# EAGLE design fish (EAGLE 9.6.2)
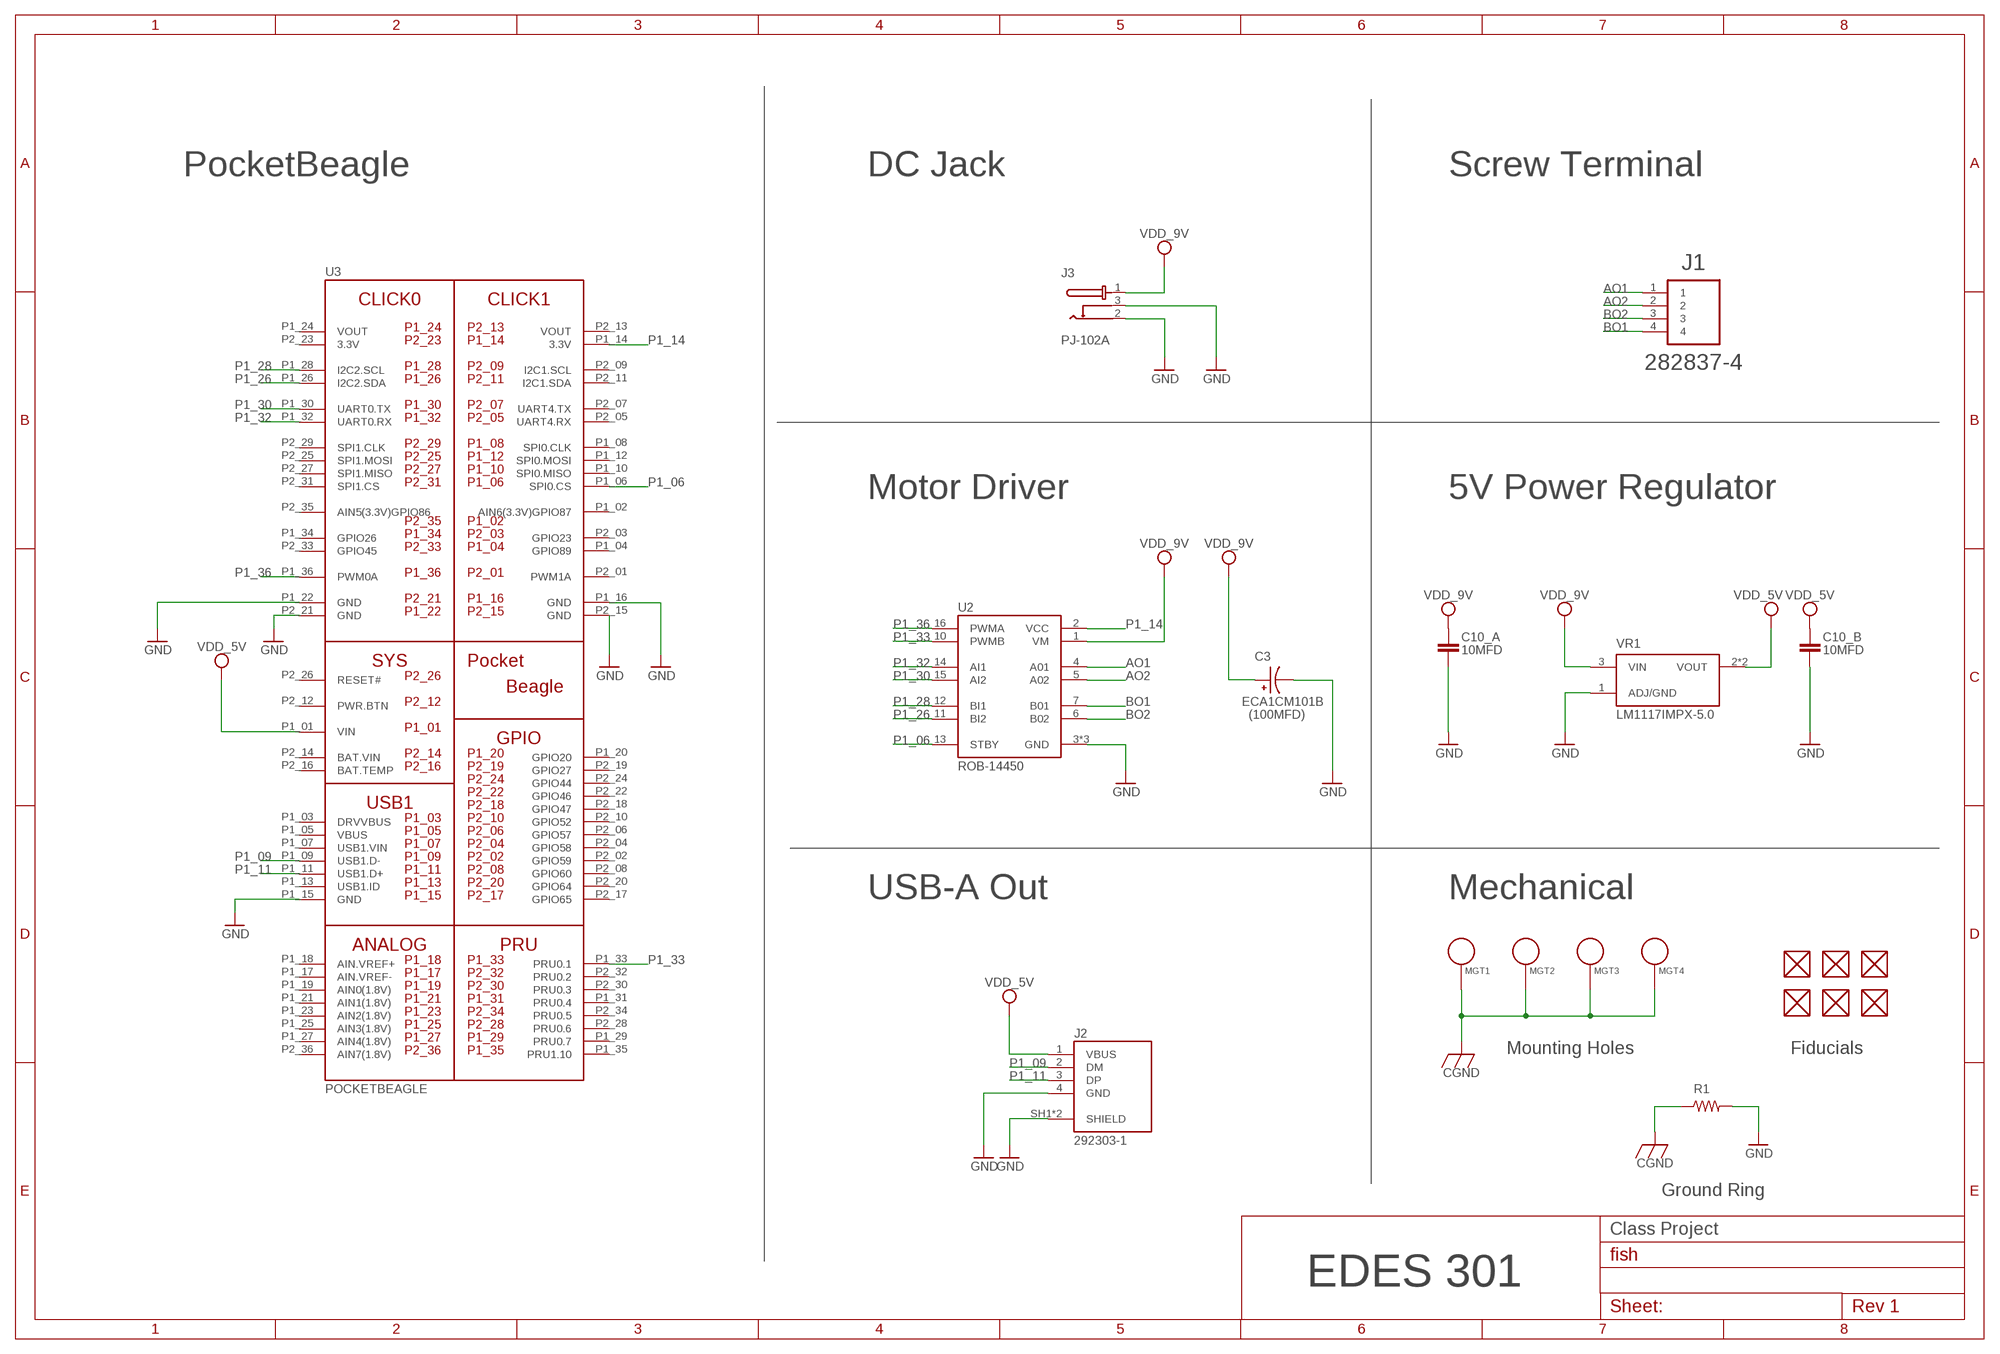
[diagram p0: schematic, sheet 1]

## Parts
C3  ECA1CM101B  [CAPPRD500W50D500H1100]
C10_A  10MFD  C_C0805  [C0805]
C10_B  10MFD  C_C0805  [C0805]
FUD1  FIDUCIAL  [FIDUCIAL_40MIL]
FUD2  FIDUCIAL  [FIDUCIAL_40MIL]
FUD3  FIDUCIAL  [FIDUCIAL_40MIL]
FUD4  FIDUCIAL  [FIDUCIAL_40MIL]
FUD5  FIDUCIAL  [FIDUCIAL_40MIL]
FUD6  FIDUCIAL  [FIDUCIAL_40MIL]
J1  282837-4  [TE_282837-4]
J2  292303-1  [TE_292303-1]
J3  PJ-102A  [CUI_PJ-102A]
MGT1  MOUNTING_HOLE  [MOUNTING_HOLE]
MGT2  MOUNTING_HOLE  [MOUNTING_HOLE]
MGT3  MOUNTING_HOLE  [MOUNTING_HOLE]
MGT4  MOUNTING_HOLE  [MOUNTING_HOLE]
R1  1 Ohm  R_R0402  [R0402]
U2  ROB-14450  [MODULE_ROB-14450]
U3  POCKETBEAGLE  [POCKETBEAGLE]
VR1  LM1117IMPX-5.0  [SOT230P700X180-4N]

## Nets
AO1: J1.1 U2.4(A01)
AO2: J1.2 U2.5(A02)
BO1: J1.4 U2.7(B01)
BO2: J1.3 U2.6(B02)
CGND: MGT1.P$1 MGT2.P$1 MGT3.P$1 MGT4.P$1 R1.1
GND: C3.N C10_A.2 C10_B.2 J2.4(GND) J2.SH1(SHIELD) J2.SH2(SHIELD) J3.2 J3.3 R1.2 U2.3(GND) U2.8(GND) U2.9(GND) U3.P1_15(GND) U3.P1_16(GND) U3.P1_22(GND) U3.P2_15(GND) U3.P2_21(GND) VR1.1(ADJ/GND)
P1_06: U2.13(STBY) U3.P1_06(SPI0.CS)
P1_09: J2.2(DM) U3.P1_09(USB1.D-)
P1_11: J2.3(DP) U3.P1_11(USB1.D+)
P1_14: U2.2(VCC) U3.P1_14(3.3V)
P1_26: U2.11(BI2) U3.P1_26(I2C2.SDA)
P1_28: U2.12(BI1) U3.P1_28(I2C2.SCL)
P1_30: U2.15(AI2) U3.P1_30(UART0.TX)
P1_32: U2.14(AI1) U3.P1_32(UART0.RX)
P1_33: U2.10(PWMB) U3.P1_33(PRU0.1)
P1_36: U2.16(PWMA) U3.P1_36(PWM0A)
VDD_5V: C10_B.1 J2.1(VBUS) U3.P1_01(VIN) VR1.2(VOUT) VR1.4(VOUT)
VDD_9V: C3.P C10_A.1 J3.1 U2.1(VM) VR1.3(VIN)
Unconnected: FUD1.P$1 FUD2.P$1 FUD3.P$1 FUD4.P$1 FUD5.P$1 FUD6.P$1 U3.P1_02(AIN6(3.3V)GPIO87) U3.P1_03(DRVVBUS) U3.P1_04(GPIO89) U3.P1_05(VBUS) U3.P1_07(USB1.VIN) U3.P1_08(SPI0.CLK) U3.P1_10(SPI0.MISO) U3.P1_12(SPI0.MOSI) U3.P1_13(USB1.ID) U3.P1_17(AIN.VREF-) U3.P1_18(AIN.VREF+) U3.P1_19(AIN0(1.8V)) U3.P1_20(GPIO20) U3.P1_21(AIN1(1.8V)) U3.P1_23(AIN2(1.8V)) U3.P1_25(AIN3(1.8V)) U3.P1_27(AIN4(1.8V)) U3.P1_29(PRU0.7) U3.P1_31(PRU0.4) U3.P1_34(GPIO26) U3.P1_35(PRU1.10) U3.P2_01(PWM1A) U3.P2_02(GPIO59) U3.P2_03(GPIO23) U3.P2_04(GPIO58) U3.P2_05(UART4.RX) U3.P2_06(GPIO57) U3.P2_07(UART4.TX) U3.P2_08(GPIO60) U3.P2_09(I2C1.SCL) U3.P2_10(GPIO52) U3.P2_11(I2C1.SDA) U3.P2_12(PWR.BTN) U3.P2_16(BAT.TEMP) U3.P2_17(GPIO65) U3.P2_18(GPIO47) U3.P2_19(GPIO27) U3.P2_20(GPIO64) U3.P2_22(GPIO46) U3.P2_24(GPIO44) U3.P2_25(SPI1.MOSI) U3.P2_26(RESET#) U3.P2_27(SPI1.MISO) U3.P2_28(PRU0.6) U3.P2_29(SPI1.CLK) U3.P2_30(PRU0.3) U3.P2_31(SPI1.CS) U3.P2_32(PRU0.2) U3.P2_33(GPIO45) U3.P2_34(PRU0.5) U3.P2_35(AIN5(3.3V)GPIO86) U3.P2_36(AIN7(1.8V))

## Notes on the sheet
- PocketBeagle | DC Jack | Screw Terminal
- Motor Driver | 5V Power Regulator
- (100MFD)
- USB-A Out | Mechanical
- Mounting Holes | Fiducials
- Ground Ring
- Class Project
- EDES 301

## Power pins joined to a net without a drawn wire
3.3V: U3.P2_23(3.3V)
BAT.VIN: U3.P2_14(BAT.VIN)
VOUT: U3.P1_24(VOUT) U3.P2_13(VOUT)

## Library data of the parts
C3 = fish:ECA1CM101B: Check availability <https://pricing.snapeda.com/parts/ECA-1CM101B/Panasonic/view-part?ref=eda>; AVAILABILITY: In Stock; CHECK_PRICES: https://www.snapeda.com/parts/ECA-1CM101B/Panasonic/view-part/?ref=eda; DESCRIPTION: Capacitor,Alum Lytic,Cap 100 uF,Tol 20%,Vol-Rtg 16 VDC,Radial,5x11,Tape&Box | Panasonic Electronic Components ECA-1CM101B; MF: Panasonic; MP: ECA-1CM101B; PACKAGE: RADIAL-2 Panasonic; PRICE: None; SNAPEDA_LINK: https://www.snapeda.com/parts/ECA-1CM101B/Panasonic/view-part/?ref=snap
C10_A C10_B = fish:C_: Capacitor SMD. Sizes: 0402, 0603 & 0805
FUD1-FUD6 = fish:FIDUCIAL
J1 = fish:282837-4: Check availability <https://pricing.snapeda.com/parts/282837-4/TE%20Connectivity/view-part?ref=eda>; AVAILABILITY: In Stock; CHECK_PRICES: https://www.snapeda.com/parts/282837-4/TE+Connectivity+AMP+Connectors/view-part/?ref=eda; COMMENT: 282837-4; DESCRIPTION: Terminal Block Connector,PCB,4,5.08 mm,Front,30-16 AWG,Green,13.5 A,250 V | TE Connectivity 282837-4; EU_ROHS_COMPLIANCE: Compliant with Exemptions; MF: TE Connectivity; MP: 282837-4; PACKAGE: None; PRICE: None; SNAPEDA_LINK: https://www.snapeda.com/parts/282837-4/TE+Connectivity+AMP+Connectors/view-part/?ref=snap
J2 = fish:292303-1: CONN USB RECEPT R/A TYPE A 4POS Check availability <https://pricing.snapeda.com/parts/292303-1/TE%20Connectivity/view-part?ref=eda>; AVAILABILITY: In Stock; CENTERLINE_PITCH: 2 mm[.078 in]; COMMENT: 292303-1; DESCRIPTION: Conn; Data; USB; Recept; 2.0; 4 Pos; 1 Port; Rt Angle; A Ser; Tin over Copper; EU_ROHS_COMPLIANCE: Compliant; MF: TE Connectivity; MP: 292303-1; NUMBER_OF_POSITIONS: 4; PACKAGE: None; PRICE: None; PRODUCT_TYPE: Connector; PURCHASE-URL: https://pricing.snapeda.com/search/part/292303-1/?ref=eda
J3 = fish:PJ-102A: Check availability <https://pricing.snapeda.com/parts/PJ-102A/Same%20Sky/view-part?ref=eda>; AVAILABILITY: In Stock; CHECK_PRICES: https://www.snapeda.com/parts/PJ-102A/Same+Sky/view-part/?ref=eda; DESCRIPTION: 2.0 x 6.5 mm, 2.5 A, Horizontal, Through Hole, Tapered Pins, Dc Power Jack Connector; MF: Same Sky; MP: PJ-102A; PACKAGE: None; PRICE: None; SNAPEDA_LINK: https://www.snapeda.com/parts/PJ-102A/Same+Sky/view-part/?ref=snap
MGT1-MGT4 = fish:MOUNTING_HOLE: Chassis Mounting Hole w/GND connection ability
R1 = fish:R_: RESISTOR, American symbol
U2 = fish:ROB-14450: Check availability <https://pricing.snapeda.com/parts/ROB-14450/SparkFun%20Electronics/view-part?ref=eda>; AVAILABILITY: Not in stock; CHECK_PRICES: https://www.snapeda.com/parts/ROB-14450/SparkFun/view-part/?ref=eda; DESCRIPTION: TB6612FNG - Motor Controller/Driver Power Management Evaluation Board; MF: SparkFun Electronics; MP: ROB-14450; PACKAGE: None; PRICE: None; PURCHASE-URL: https://www.snapeda.com/api/url_track_click_mouser/?unipart_id=2656367&manufacturer=SparkFun Electronics&part_name=ROB-14450&search_term=None; SNAPEDA_LINK: https://www.snapeda.com/parts/ROB-14450/SparkFun/view-part/?ref=snap
U3 = fish:POCKETBEAGLE
VR1 = fish:LM1117IMPX-5.0: Check availability <https://pricing.snapeda.com/parts/LM1117IMPX-5.0/Texas%20Instruments/view-part?ref=eda>; AVAILABILITY: In Stock; CHECK_PRICES: https://www.snapeda.com/parts/LM1117IMPX-5.0/Texas+Instruments/view-part/?ref=eda; DESCRIPTION: Linear Voltage Regulator IC Positive Fixed 1 Output 800mA SOT-223-4; MF: Texas Instruments; MP: LM1117IMPX-5.0; PACKAGE: SOT-223-4 Texas Instruments; PRICE: None; SNAPEDA_LINK: https://www.snapeda.com/parts/LM1117IMPX-5.0/Texas+Instruments/view-part/?ref=snap

## Board
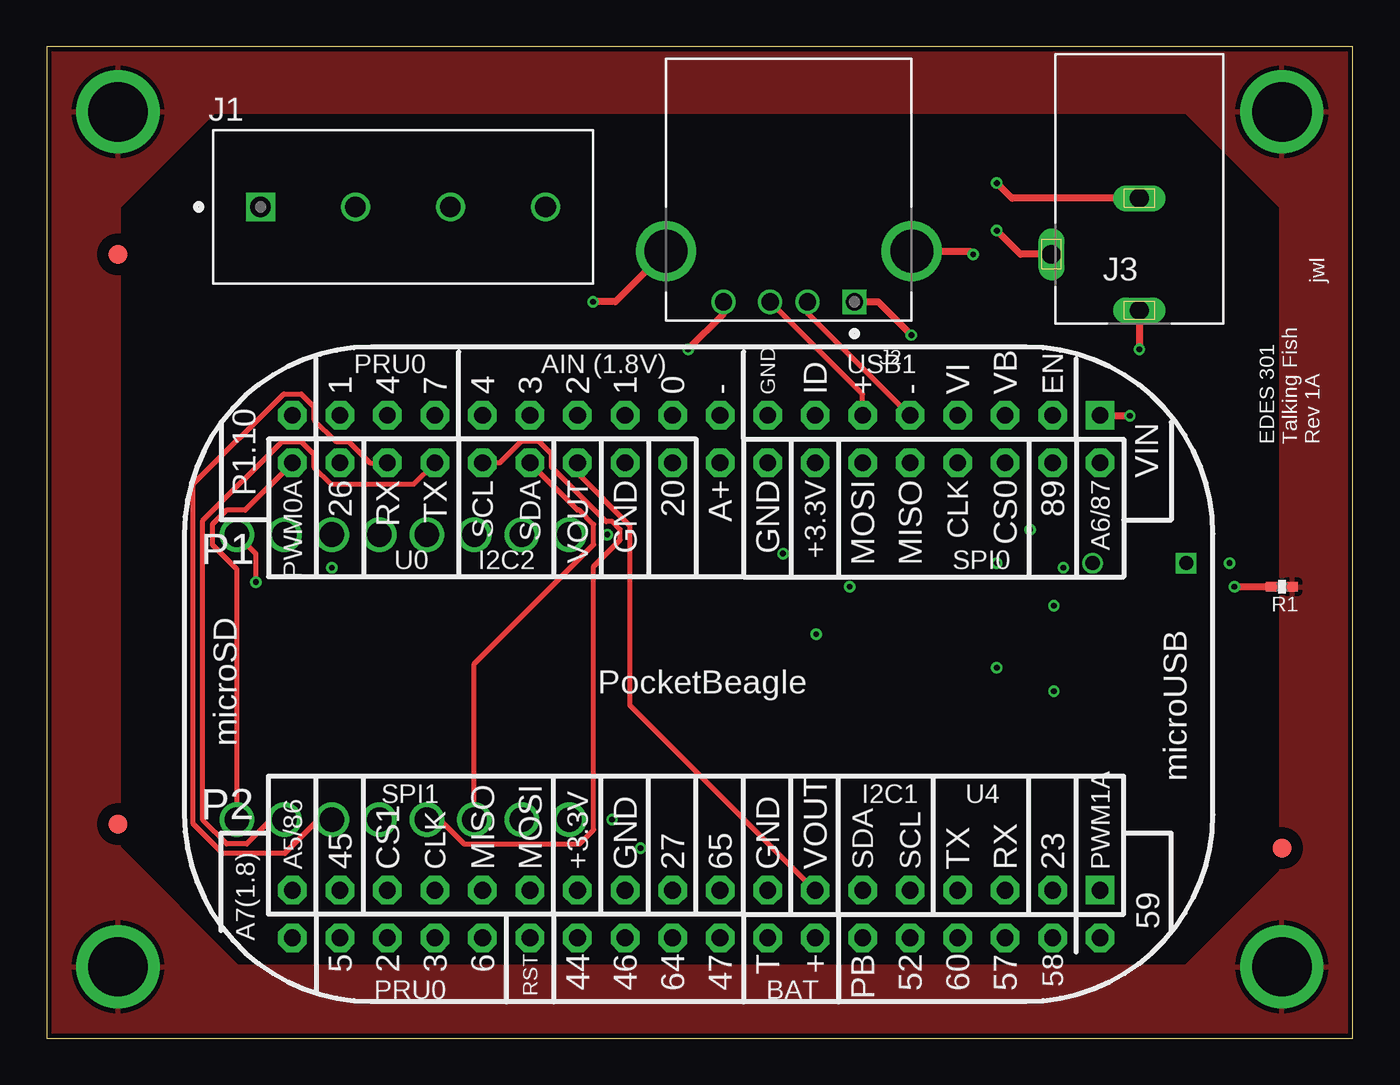
[diagram p1: board, top side]
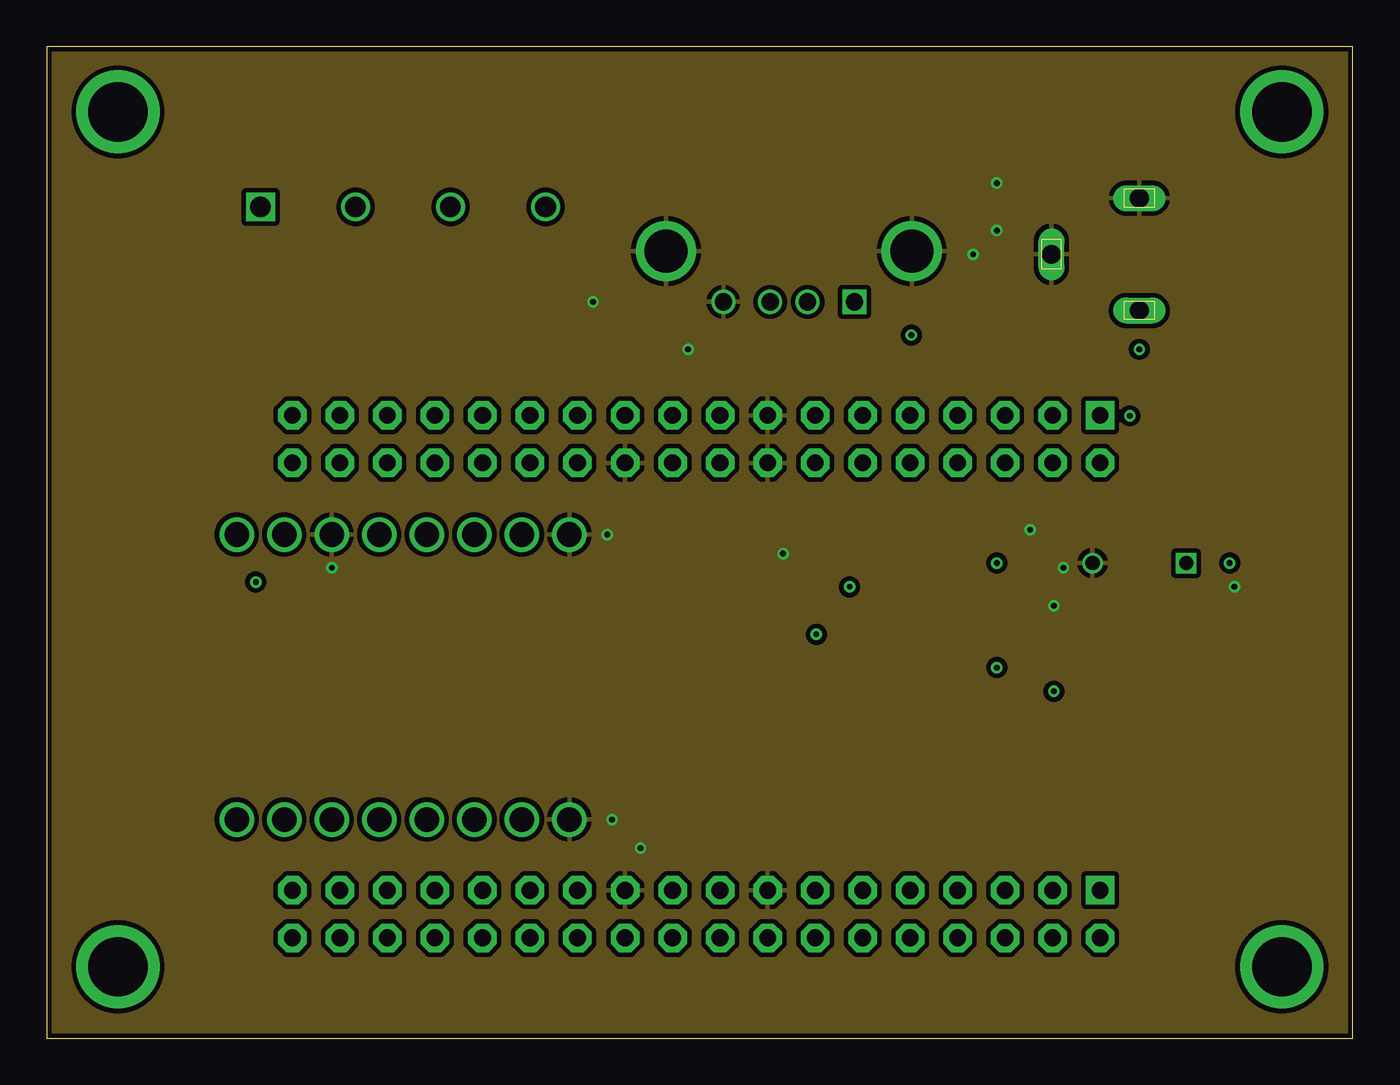
[diagram p2: board, inner layer Route2]
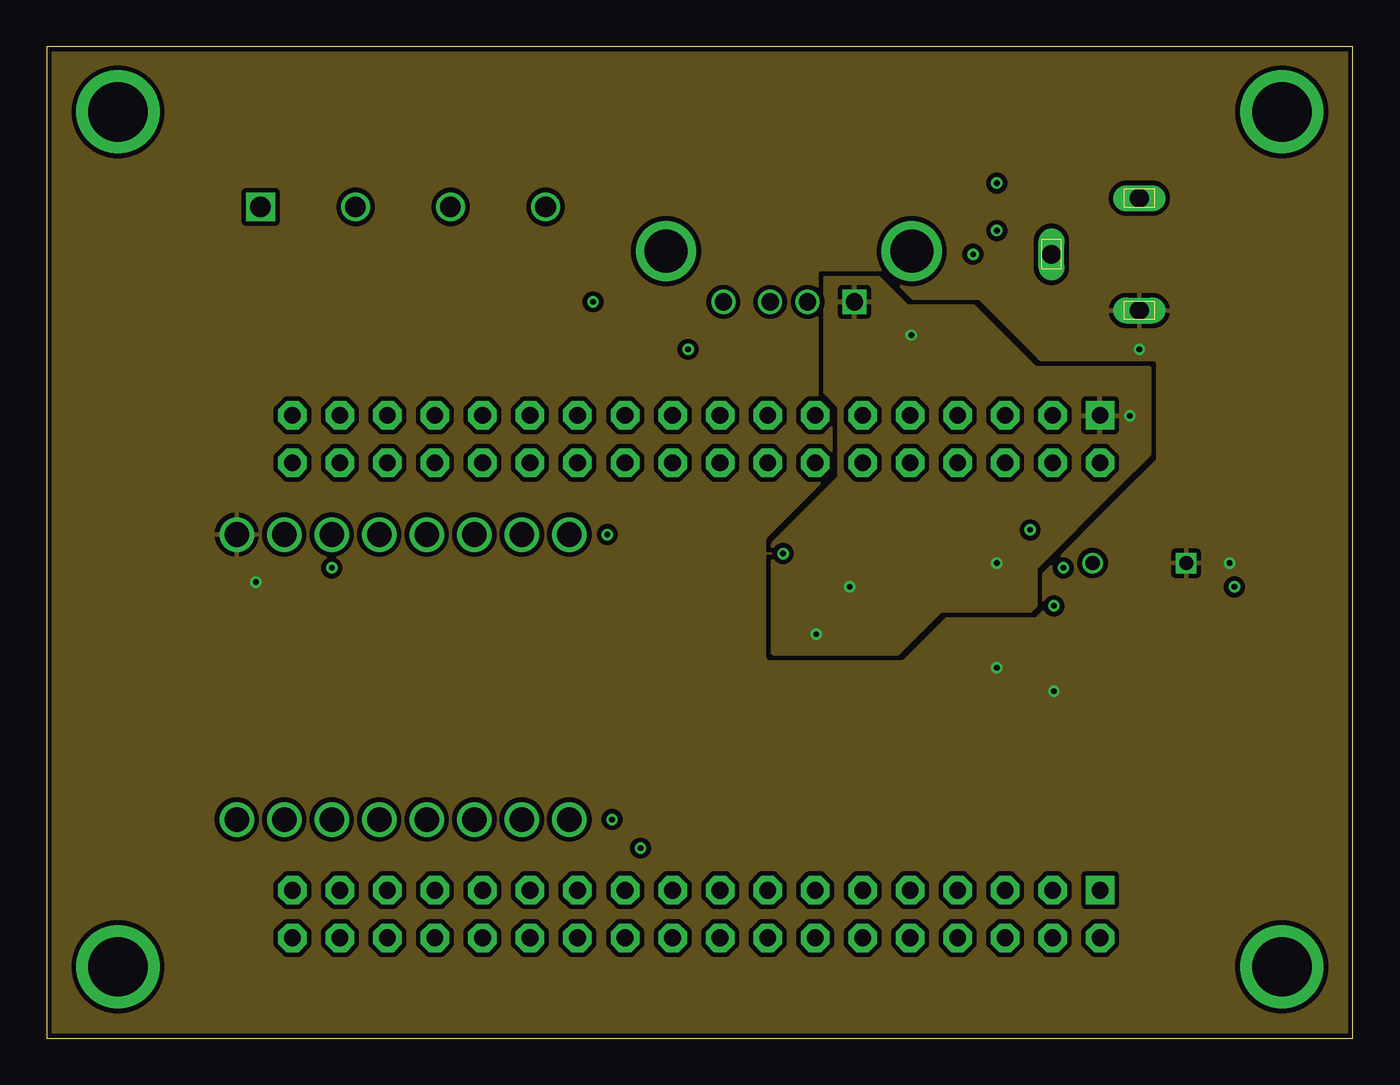
[diagram p3: board, inner layer Route15]
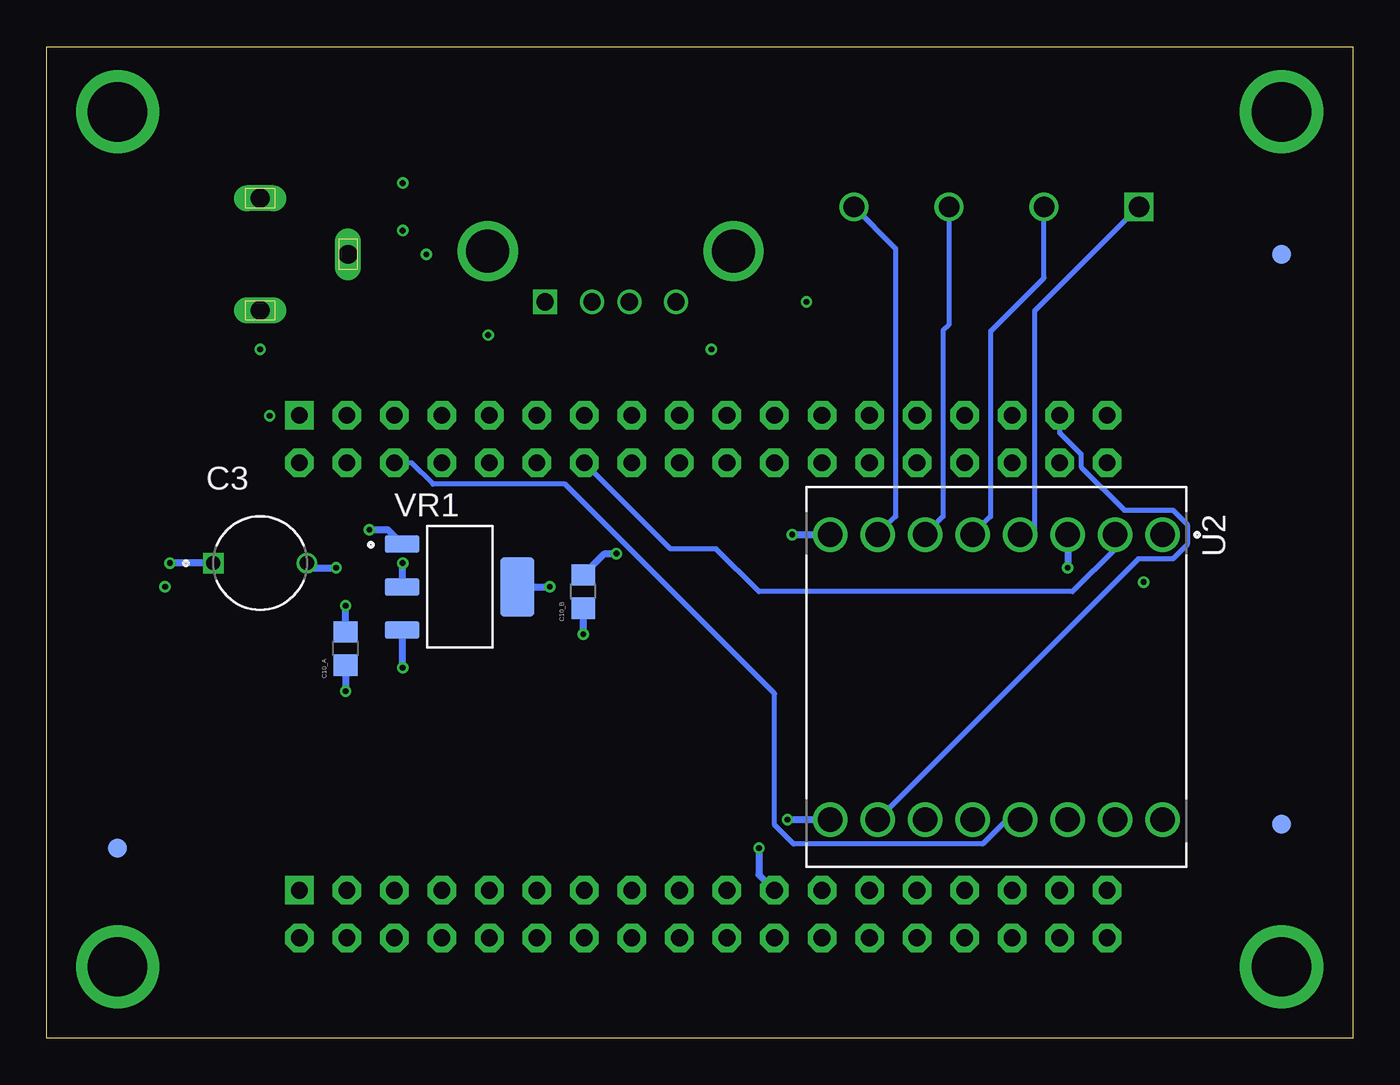
[diagram p4: board, bottom side, seen from below]

Size 69.83 x 53.01 mm. Coordinates in mm from the lower left corner, seen from the top.
Outline: 0,0 69.83,0 69.83,53.01 0,53.01 0,0
Copper layers (1*2*15*16): Top 0.035mm / dielectric 0.23mm / Route2 0.035mm / dielectric 0.93mm / Route15 0.035mm / dielectric 0.23mm / Bottom 0.035mm
Design rules "EDES301_4lyr": minimum track width 10mil, minimum drill 12mil, track to track 10mil, track to pad 10mil, pad to pad 10mil, via to via 10mil, smd to smd 10mil, copper to edge 10mil, drill to drill 12mil, minimum pad ring 6mil, minimum via ring 6mil, stop-mask expansion 3mil, vias tented up to drill 25mil, thermal gap 10mil

### Footprints (pad centres in the part's own frame; a part is rotated, then mirrored left to right if it is on the bottom)
CAPPRD500W50D500H1100 = drill 0.75 pad 1.1: N 2.5,0 | drill 0.75 pad 1.1 square: P -2.5,0
C0805 = smd 1.143 x 1.27: 1 -0.889,0; 2 0.889,0
FIDUCIAL_40MIL = smd 1.016 x 1.016: P$1 0,0
TE_282837-4 = drill 1.1 square: 1 0,0 | drill 1.1: 2 5.08,0; 3 10.16,0; 4 15.24,0
TE_292303-1 = drill 0.92 square: 1 0,0 | drill 0.92: 2 2.5,0; 3 4.5,0; 4 7,0 | drill 2.3: SH1 -3.07,-2.71; SH2 10.07,-2.71
CUI_PJ-102A = drill 1 long: 1 0,-3; 2 0,3; 3 -4.7,0
MOUNTING_HOLE = drill 3.175 pad 4.445: P$1 0,0
R0402 = smd 0.61 x 0.508: 1 -0.559,0; 2 0.559,0
MODULE_ROB-14450 = drill 1.32: 1 -7.62,8.89; 2 -7.62,6.35; 3 -7.62,3.81; 4 -7.62,1.27; 5 -7.62,-1.27; 6 -7.62,-3.81; 7 -7.62,-6.35; 8 -7.62,-8.89; 9 7.62,-8.89; 10 7.62,-6.35; 11 7.62,-3.81; 12 7.62,-1.27; 13 7.62,1.27; 14 7.62,3.81; 15 7.62,6.35; 16 7.62,8.89
POCKETBEAGLE = drill 0.889 pad 1.524 square: P1_01 5.91,3.53; P2_01 5.91,28.93 | drill 0.889 pad 1.524 octagon: P1_02 5.91,6.07; P1_03 8.45,3.53; P1_04 8.45,6.07; P1_05 10.99,3.53; P1_06 10.99,6.07; P1_07 13.53,3.53; P1_08 13.53,6.07; P1_09 16.07,3.53; P1_10 16.07,6.07; P1_11 18.61,3.53; P1_12 18.61,6.07; P1_13 21.15,3.53; P1_14 21.15,6.07; P1_15 23.69,3.53; P1_16 23.69,6.07; P1_17 26.23,3.53; P1_18 26.23,6.07; P1_19 28.77,3.53; P1_20 28.77,6.07; P1_21 31.31,3.53; P1_22 31.31,6.07; P1_23 33.85,3.53; P1_24 33.85,6.07; P1_25 36.39,3.53; P1_26 36.39,6.07; P1_27 38.93,3.53; P1_28 38.93,6.07; P1_29 41.47,3.53; P1_30 41.47,6.07; P1_31 44.01,3.53; P1_32 44.01,6.07; P1_33 46.55,3.53; P1_34 46.55,6.07; P1_35 49.09,3.53; P1_36 49.09,6.07; P2_02 5.91,31.47; P2_03 8.45,28.93; P2_04 8.45,31.47; P2_05 10.99,28.93; P2_06 10.99,31.47; P2_07 13.53,28.93; P2_08 13.53,31.47; P2_09 16.07,28.93; P2_10 16.07,31.47; P2_11 18.61,28.93; P2_12 18.61,31.47; P2_13 21.15,28.93; P2_14 21.15,31.47; P2_15 23.69,28.93; P2_16 23.69,31.47; P2_17 26.23,28.93; P2_18 26.23,31.47; P2_19 28.77,28.93; P2_20 28.77,31.47; P2_21 31.31,28.93; P2_22 31.31,31.47; P2_23 33.85,28.93; P2_24 33.85,31.47; P2_25 36.39,28.93; P2_26 36.39,31.47; P2_27 38.93,28.93; P2_28 38.93,31.47; P2_29 41.47,28.93; P2_30 41.47,31.47; P2_31 44.01,28.93; P2_32 44.01,31.47; P2_33 46.55,28.93; P2_34 46.55,31.47; P2_35 49.09,28.93; P2_36 49.09,31.47
SOT230P700X180-4N = smd 1.84 x 0.93: 1 -3.085,2.3; 2 -3.085,0; 3 -3.085,-2.3 | smd 1.84 x 3.19: 4 3.085,0

### Placement (x,y rotation side)
C3  58.42,25.4 0 bottom
C10_A  53.85,20.83 90 bottom
C10_B  41.15,23.88 90 bottom
FUD1  66.04,10.16 0 bottom
FUD2  3.81,41.91 0 bottom
FUD3  66.04,10.16 0 top
FUD4  3.81,11.43 0 top
FUD5  3.81,11.43 0 bottom
FUD6  3.81,41.91 0 top
J1  11.43,44.45 0 top
J2  43.18,39.37 180 top
J3  58.42,41.91 0 top
MGT1  3.81,3.81 0 bottom
MGT2  3.81,49.53 0 top
MGT3  66.04,49.53 0 top
MGT4  66.04,3.81 0 top
R1  66.04,24.13 180 top
U2  19.05,19.3 270 bottom
U3  62.23,36.83 180 top
VR1  47.75,24.13 0 bottom

### Tracks (layer width: path | path; a pad name or v marks a point on that pad's centre or on a via)
AO1
  Bottom 0.254: U2.4 17.27,26.92 17.02,27.18 17.02,38.86 J1.1
AO2
  Bottom 0.254: U2.5 19.36,27.88 19.36,37.79 16.51,40.64 J1.2
BO1
  Bottom 0.254: U2.7 24.44,27.88 24.44,42.22 J1.4
BO2
  Bottom 0.254: U2.6 21.9,27.88 21.9,37.85 21.59,38.16 J1.3
CGND
  pour Top: -1.27,26.67 3.81,26.67 3.81,10.16 10.16,3.81 60.96,3.81 66.04,8.89 66.04,26.67 71.12,26.67 71.12,-1.27 -1.27,-1.27
  pour Top: -1.27,26.67 -1.27,54.61 71.12,54.61 71.12,26.67 66.04,26.67 66.04,44.45 60.96,49.53 8.89,49.53 3.81,44.45 3.81,26.67
GND  (via drill 0.3 pad 0.61)
  Top 0.381: J2.SH1 49.36,42.08 v49.53,41.91 | J3.3 52.07,41.91 v50.8,43.18 | J3.2 51.61,44.91 v50.8,45.72 | R1.2 v63.5,24.13 | J2.SH2 30.4,39.37 v29.21,39.37 | J2.4 36.18,38.72 v34.29,36.83
  Bottom 0.381: v29.97,26.92 U2.8 | v30.23,11.68 U2.9 | v31.75,10.16 31.75,8.73 U3.P2_21 | C10_B.2 40.01,25.91 v39.37,25.91 | U2.3 v15.24,25.15 | C10_A.2 v53.85,23.11 | C3.N 55.67,25.15 v54.36,25.15 | VR1.1 51.59,27.18 v52.58,27.18
  pour Route2: -7.62,-6.35 -7.62,60.96 72.39,60.96 72.39,-6.35
P1_06
  Bottom 0.254: U3.P1_06 50.32,30.76 49.17,29.62 42.11,29.62 30.91,18.42 30.91,11.4 29.89,10.38 19.78,10.38 18.47,11.68 U2.13
P1_09
  Top 0.254: U3.P1_09 40.68,38.78 J2.2
P1_11
  Top 0.254: U3.P1_11 43.62,34.43 J2.3
P1_14
  Bottom 0.254: U2.2 12.7,26.16 14.99,23.88 31.75,23.88 34.04,26.16 36.48,26.16 U3.P1_14
P1_26
  Top 0.254: U2.11 22.86,20 29.25,26.38 29.25,27.46 28.48,28.23 28.37,28.23 U3.P1_26
P1_28
  Top 0.254: U3.P1_28 24.22,30.76 25.37,31.9 26.31,31.9 26.98,31.23 26.98,30.54 29.91,27.61 30.26,27.61 30.66,27.21 30.66,26.64 29.25,25.23 29.25,11.14 28.48,10.38 22.32,10.38 21.01,11.68 U2.12
P1_30
  Top 0.254: U2.15 12.01,11.68 10.7,10.38 9.62,10.38 8.35,11.65 8.35,27.68 12.57,31.9 13.61,31.9 14.28,31.23 14.28,30.54 15.21,29.62 19.62,29.62 U3.P1_30
P1_32
  Top 0.254: U3.P1_32 17.3,30.76 16.15,31.9 15.46,31.9 14.28,33.08 14.28,33.77 13.61,34.44 12.67,34.44 7.84,29.61 7.84,11.44 9.41,9.87 12.73,9.87 14.55,11.68 U2.14
P1_33
  Bottom 0.254: U3.P1_33 15.68,32.38 14.54,31.23 14.54,30.54 12.22,28.23 9.62,28.23 8.86,27.46 8.86,26.38 9.62,25.62 11.46,25.62 U2.10
P1_36
  Top 0.254: U3.P1_36 10.61,28.23 9.62,28.23 8.86,27.46 8.86,26.38 10.16,25.08 U2.16
VDD_5V  (via drill 0.3 pad 0.61)
  Top 0.381: J2.1 44.45,39.37 v46.23,37.59 | U3.P1_01 57.89,33.3 v57.91,33.27
  Bottom 0.381: C10_B.1 v41.15,21.59 | VR1.4 v42.93,24.13 | VR1.2 50.8,24.17 v50.8,25.4
  pour Route15: 41.66,40.64 44.45,40.64 45.97,39.12 49.53,39.12 52.58,36.07 52.83,35.81 58.93,35.81 58.93,31.24 57.15,29.46 52.83,25.15 52.83,23.11 52.58,22.86 47.75,22.86 45.47,20.57 38.86,20.57 38.86,24.13 38.86,26.42 42.42,29.97 42.42,33.78 41.66,34.54
VDD_9V  (via drill 0.3 pad 0.61)
  Top 0.254: U2.1 11.18,25.91 v11.18,24.38
  Top 0.381: J3.1 v58.42,36.83
  Bottom 0.381: C3.P v63.25,25.4 | C10_A.1 v53.85,18.54 | VR1.3 50.84,19.85 v50.8,19.81
  pour Route15 (rank 2): -10.16,-10.16 -10.16,64.77 74.93,64.77 74.93,-8.89 -7.62,-8.89 -8.89,-10.16
VOUT
  Top 0.254: U3.P1_24 28.38,30.2 31.17,27.42 31.17,17.81 U3.P2_13

### Text on the board
tPlace: jwl | EDES 301 / Talking Fish / Rev 1A